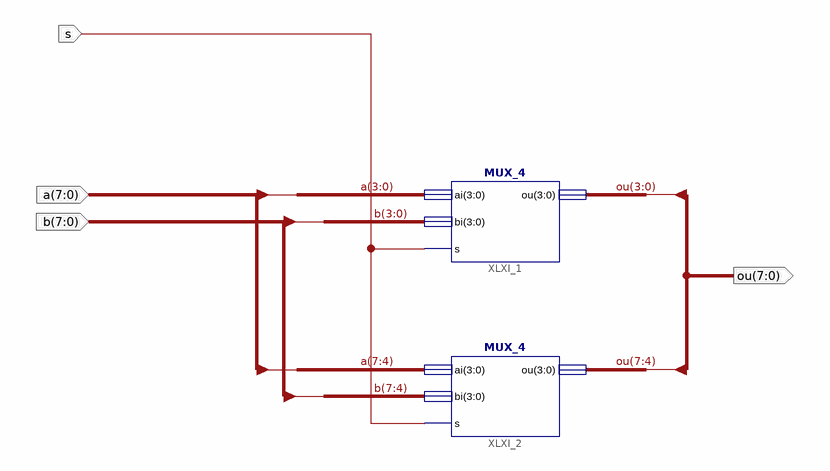
[diagram p0: schematic sheet 1]
// Xilinx ISE schematic MUX_8.sch (kintex7) as structural Verilog: 2 symbols, 4 ports
module MUX_8 (
  input  s,
  input  [7:0] a,
  input  [7:0] b,
  output [7:0] ou
);

  MUX_4 XLXI_1 (.ai(a[3:0]), .bi(b[3:0]), .s(s), .ou(ou[3:0]));
  MUX_4 XLXI_2 (.ai(a[7:4]), .bi(b[7:4]), .s(s), .ou(ou[7:4]));
endmodule
